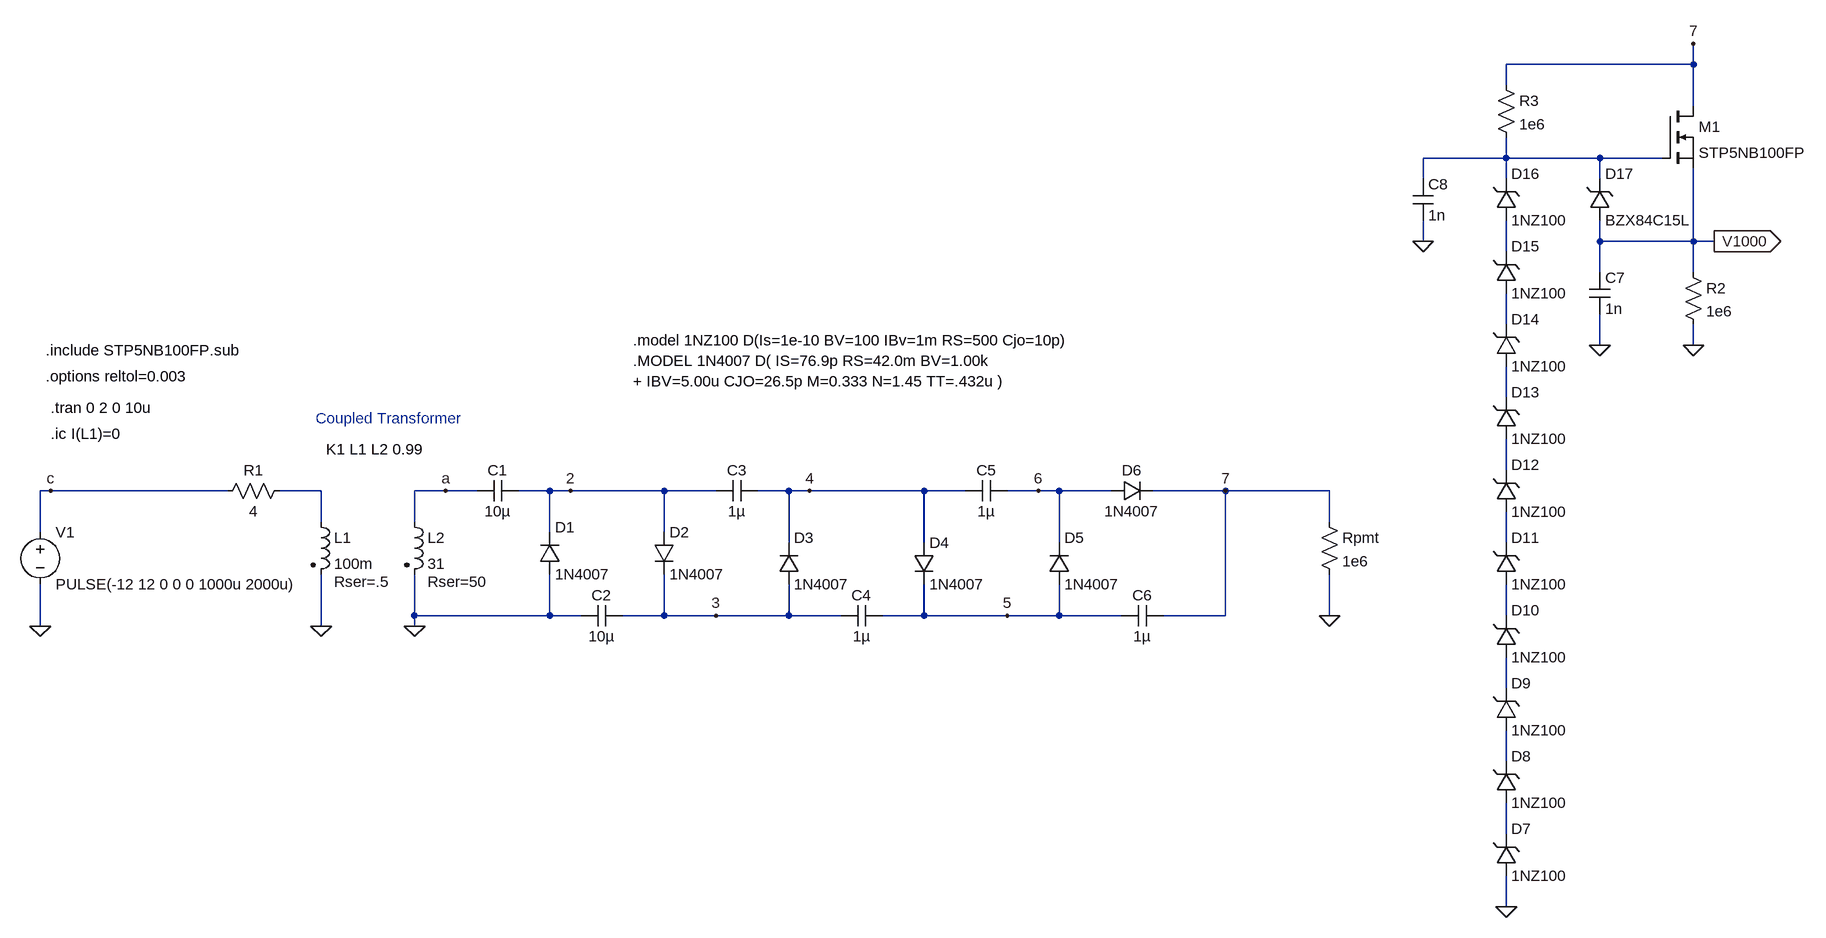
[diagram p0: schematic hochspannung_high_voltage_1kV.asc]
hochspannung_high_voltage_1kV.asc, the LTspice schematic file:
Version 4
SHEET 1 2848 1092
WIRE 2080 -496 2080 -528
WIRE 2080 -496 1792 -496
WIRE 1792 -464 1792 -496
WIRE 2080 -432 2080 -496
WIRE 1792 -352 1792 -384
WIRE 1792 -352 1664 -352
WIRE 1936 -352 1792 -352
WIRE 2032 -352 1936 -352
WIRE 1664 -320 1664 -352
WIRE 1792 -320 1792 -352
WIRE 1936 -320 1936 -352
WIRE 1664 -224 1664 -256
WIRE 1936 -224 1936 -256
WIRE 2080 -224 2080 -336
WIRE 2080 -224 1936 -224
WIRE 2112 -224 2080 -224
WIRE 1792 -208 1792 -256
WIRE 1936 -176 1936 -224
WIRE 2080 -176 2080 -224
WIRE 1792 -96 1792 -144
WIRE 1936 -64 1936 -112
WIRE 2080 -64 2080 -96
WIRE 1792 16 1792 -32
WIRE 1792 128 1792 80
WIRE -448 160 -464 160
WIRE -176 160 -448 160
WIRE -32 160 -96 160
WIRE 160 160 112 160
WIRE 208 160 160 160
WIRE 320 160 272 160
WIRE 352 160 320 160
WIRE 496 160 352 160
WIRE 576 160 496 160
WIRE 688 160 640 160
WIRE 720 160 688 160
WIRE 896 160 720 160
WIRE 960 160 896 160
WIRE 1072 160 1024 160
WIRE 1104 160 1072 160
WIRE 1184 160 1104 160
WIRE 1360 160 1248 160
WIRE 1520 160 1360 160
WIRE -32 208 -32 160
WIRE 112 208 112 160
WIRE 1520 208 1520 160
WIRE -464 224 -464 160
WIRE 320 224 320 160
WIRE 496 224 496 160
WIRE 688 240 688 160
WIRE 896 240 896 160
WIRE 1104 240 1104 160
WIRE 1792 240 1792 192
WIRE 112 352 112 288
WIRE 320 352 320 288
WIRE 320 352 112 352
WIRE 368 352 320 352
WIRE 496 352 496 288
WIRE 496 352 432 352
WIRE 576 352 496 352
WIRE 688 352 688 304
WIRE 688 352 576 352
WIRE 768 352 688 352
WIRE 896 352 896 304
WIRE 896 352 832 352
WIRE 1024 352 896 352
WIRE 1104 352 1104 304
WIRE 1104 352 1024 352
WIRE 1200 352 1104 352
WIRE 1360 352 1360 160
WIRE 1360 352 1264 352
WIRE 1520 352 1520 288
WIRE 1792 352 1792 304
WIRE -464 368 -464 304
WIRE -32 368 -32 288
WIRE 112 368 112 352
WIRE 1792 464 1792 416
WIRE 1792 576 1792 528
WIRE 1792 688 1792 640
WIRE 1792 800 1792 752
FLAG -464 368 0
FLAG -448 160 c
FLAG -32 368 0
FLAG 112 368 0
FLAG 160 160 a
FLAG 352 160 2
FLAG 720 160 4
FLAG 1072 160 6
FLAG 576 352 3
FLAG 1024 352 5
FLAG 1360 160 7
FLAG 1520 352 0
FLAG 2080 -528 7
FLAG 2080 -64 0
FLAG 1792 800 0
FLAG 2112 -224 V1000
IOPIN 2112 -224 Out
FLAG 1936 -64 0
FLAG 1664 -224 0
SYMBOL voltage -464 208 R0
WINDOW 123 0 0 Left 0
WINDOW 39 0 0 Left 0
SYMATTR InstName V1
SYMATTR Value PULSE(-12 12 0 0 0 1000u 2000u)
SYMBOL res -192 176 R270
WINDOW 0 32 56 VTop 0
WINDOW 3 0 56 VBottom 0
SYMATTR InstName R1
SYMATTR Value 4
SYMBOL ind2 -48 192 R0
WINDOW 39 36 108 Left 0
SYMATTR InstName L1
SYMATTR Value 100m
SYMATTR Type ind
SYMATTR SpiceLine Rser=.5
SYMBOL ind2 96 192 R0
WINDOW 39 36 108 Left 0
SYMATTR InstName L2
SYMATTR Value 31
SYMATTR Type ind
SYMATTR SpiceLine Rser=50
SYMBOL cap 208 176 R270
WINDOW 0 32 32 VTop 0
WINDOW 3 0 32 VBottom 0
SYMATTR InstName C1
SYMATTR Value 10µ
SYMBOL cap 576 176 R270
WINDOW 0 32 32 VTop 0
WINDOW 3 0 32 VBottom 0
SYMATTR InstName C3
SYMATTR Value 1µ
SYMBOL diode 304 288 M180
WINDOW 0 24 72 Left 0
WINDOW 3 24 0 Left 0
SYMATTR InstName D1
SYMATTR Value 1N4007
SYMBOL cap 960 176 R270
WINDOW 0 32 32 VTop 0
WINDOW 3 0 32 VBottom 0
SYMATTR InstName C5
SYMATTR Value 1µ
SYMBOL diode 480 224 R0
SYMATTR InstName D2
SYMATTR Value 1N4007
SYMBOL diode 672 304 M180
WINDOW 0 24 72 Left 0
WINDOW 3 24 0 Left 0
SYMATTR InstName D3
SYMATTR Value 1N4007
SYMBOL diode 880 240 R0
SYMATTR InstName D4
SYMATTR Value 1N4007
SYMBOL diode 1088 304 M180
WINDOW 0 24 72 Left 0
WINDOW 3 24 0 Left 0
SYMATTR InstName D5
SYMATTR Value 1N4007
SYMBOL diode 1184 176 R270
WINDOW 0 32 32 VTop 0
WINDOW 3 0 32 VBottom 0
SYMATTR InstName D6
SYMATTR Value 1N4007
SYMBOL res 1504 192 R0
SYMATTR InstName Rpmt
SYMATTR Value 1e6
SYMBOL cap 368 368 R270
WINDOW 0 32 32 VTop 0
WINDOW 3 0 32 VBottom 0
SYMATTR InstName C2
SYMATTR Value 10µ
SYMBOL cap 768 368 R270
WINDOW 0 32 32 VTop 0
WINDOW 3 0 32 VBottom 0
SYMATTR InstName C4
SYMATTR Value 1µ
SYMBOL cap 1200 368 R270
WINDOW 0 32 32 VTop 0
WINDOW 3 0 32 VBottom 0
SYMATTR InstName C6
SYMATTR Value 1µ
SYMBOL nmos 2032 -432 R0
SYMATTR InstName M1
SYMATTR Value STP5NB100FP
SYMATTR Prefix X
SYMBOL res 2064 -192 R0
SYMATTR InstName R2
SYMATTR Value 1e6
SYMBOL zener 1776 752 M180
WINDOW 0 24 72 Left 0
WINDOW 3 24 0 Left 0
SYMATTR InstName D7
SYMATTR Value 1NZ100
SYMBOL zener 1776 640 M180
WINDOW 0 24 72 Left 0
WINDOW 3 24 0 Left 0
SYMATTR InstName D8
SYMATTR Value 1NZ100
SYMBOL zener 1776 528 M180
WINDOW 0 24 72 Left 0
WINDOW 3 24 0 Left 0
SYMATTR InstName D9
SYMATTR Value 1NZ100
SYMBOL zener 1776 416 M180
WINDOW 0 24 72 Left 0
WINDOW 3 24 0 Left 0
SYMATTR InstName D10
SYMATTR Value 1NZ100
SYMBOL zener 1776 304 M180
WINDOW 0 24 72 Left 0
WINDOW 3 24 0 Left 0
SYMATTR InstName D11
SYMATTR Value 1NZ100
SYMBOL zener 1776 192 M180
WINDOW 0 24 72 Left 0
WINDOW 3 24 0 Left 0
SYMATTR InstName D12
SYMATTR Value 1NZ100
SYMBOL zener 1776 80 M180
WINDOW 0 24 72 Left 0
WINDOW 3 24 0 Left 0
SYMATTR InstName D13
SYMATTR Value 1NZ100
SYMBOL zener 1776 -32 M180
WINDOW 0 24 72 Left 0
WINDOW 3 24 0 Left 0
SYMATTR InstName D14
SYMATTR Value 1NZ100
SYMBOL zener 1776 -144 M180
WINDOW 0 24 72 Left 0
WINDOW 3 24 0 Left 0
SYMATTR InstName D15
SYMATTR Value 1NZ100
SYMBOL zener 1776 -256 M180
WINDOW 0 24 72 Left 0
WINDOW 3 24 0 Left 0
SYMATTR InstName D16
SYMATTR Value 1NZ100
SYMBOL res 1776 -480 R0
SYMATTR InstName R3
SYMATTR Value 1e6
SYMBOL zener 1920 -256 M180
WINDOW 0 24 72 Left 0
WINDOW 3 24 0 Left 0
SYMATTR InstName D17
SYMATTR Value BZX84C15L
SYMBOL cap 1920 -176 R0
SYMATTR InstName C7
SYMATTR Value 1n
SYMBOL cap 1648 -320 R0
SYMATTR InstName C8
SYMATTR Value 1n
TEXT -24 96 Left 0 !K1 L1 L2 0.99
TEXT 448 -40 Left 0 !.MODEL 1N4007 D( IS=76.9p RS=42.0m BV=1.00k\n+ IBV=5.00u CJO=26.5p M=0.333 N=1.45 TT=.432u )
TEXT -448 32 Left 0 !.tran 0 2 0 10u
TEXT -448 72 Left 0 !.ic I(L1)=0
TEXT 448 -72 Left 0 !.model 1NZ100 D(Is=1e-10 BV=100 IBv=1m RS=500 Cjo=10p)
TEXT -456 -16 Left 0 !.options reltol=0.003
TEXT -40 48 Left 0 ;Coupled Transformer
TEXT -456 -56 Left 0 !.include STP5NB100FP.sub

The netlist it stands for:
* hochspannung_high_voltage_1kV.asc
V1 c 0 PULSE(-12 12 0 0 0 1000u 2000u)
R1 c N006 4
L1 N006 0 100m Rser=.5
L2 a 0 31 Rser=50
C1 a 2 10µ
C3 2 4 1µ
D1 0 2 1N4007
C5 4 6 1µ
D2 2 3 1N4007
D3 3 4 1N4007
D4 4 5 1N4007
D5 5 6 1N4007
D6 6 7 1N4007
Rpmt 7 0 1e6
C2 0 3 10µ
C4 3 5 1µ
C6 5 7 1µ
XM1 7 N001 V1000 STP5NB100FP  ; pins D G S
R2 V1000 0 1e6
D7 0 N011 1NZ100
D8 N011 N010 1NZ100
D9 N010 N009 1NZ100
D10 N009 N008 1NZ100
D11 N008 N007 1NZ100
D12 N007 N005 1NZ100
D13 N005 N004 1NZ100
D14 N004 N003 1NZ100
D15 N003 N002 1NZ100
D16 N002 N001 1NZ100
R3 7 N001 1e6
D17 V1000 N001 BZX84C15L
C7 V1000 0 1n
C8 N001 0 1n
.model D D
.lib standard.dio
K1 L1 L2 0.99
.MODEL 1N4007 D( IS=76.9p RS=42.0m BV=1.00k
+ IBV=5.00u CJO=26.5p M=0.333 N=1.45 TT=.432u )
.tran 0 2 0 10u
.ic I(L1)=0
.model 1NZ100 D(Is=1e-10 BV=100 IBv=1m RS=500 Cjo=10p)
.options reltol=0.003
* Coupled Transformer
.include STP5NB100FP.sub
.backanno
.end